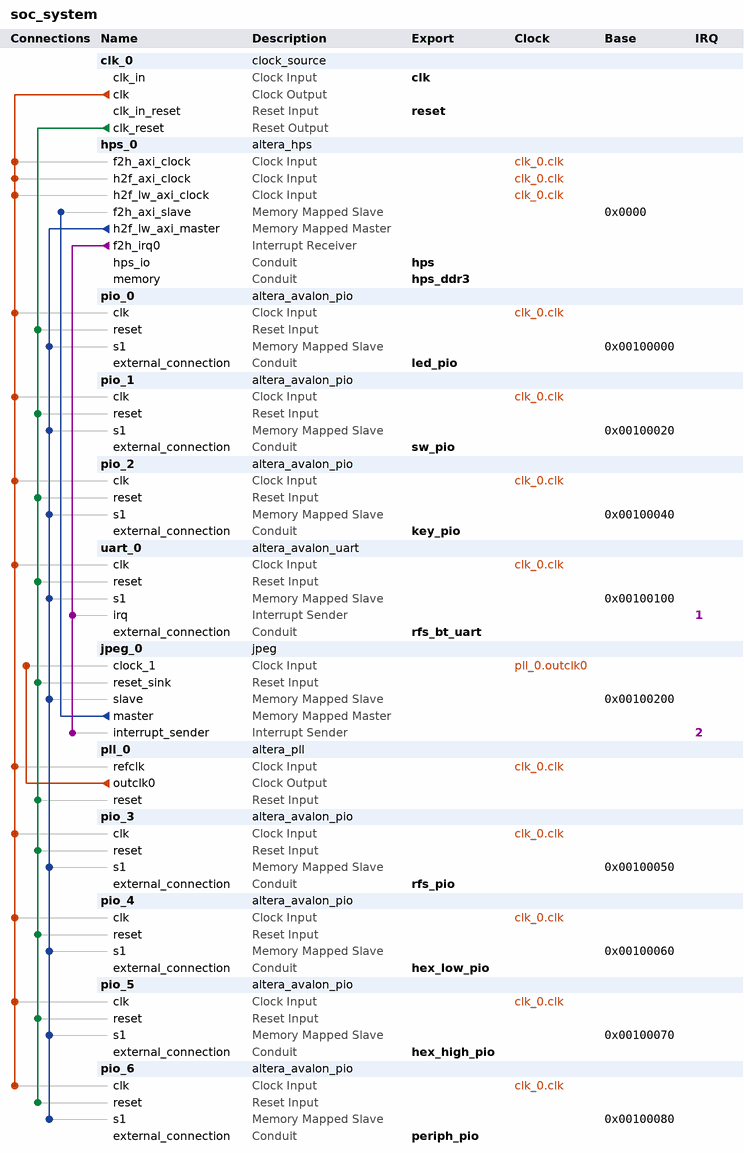
[diagram p0: system contents]
# Platform Designer (Qsys) system soc_system, Cyclone V 5CSEMA5F31C6
# Parameters at their usual value, and those the tool derives, are not listed.
package require -exact qsys 20.1
create_system soc_system
set_project_property DEVICE_FAMILY {Cyclone V}
set_project_property DEVICE 5CSEMA5F31C6

add_instance clk_0 clock_source 20.1
set_instance_parameter_value clk_0 clockFrequency 50000000

add_instance hps_0 altera_hps 20.1
set_instance_parameter_value hps_0 EMAC1_Mode RGMII
set_instance_parameter_value hps_0 EMAC1_PinMuxing {HPS I/O Set 0}
set_instance_parameter_value hps_0 F2SCLK_COLDRST_Enable false
set_instance_parameter_value hps_0 F2SCLK_DBGRST_Enable false
set_instance_parameter_value hps_0 F2SCLK_WARMRST_Enable false
set_instance_parameter_value hps_0 F2SINTERRUPT_Enable true
set_instance_parameter_value hps_0 F2S_Width 2
set_instance_parameter_value hps_0 FPGA_PERIPHERAL_OUTPUT_CLOCK_FREQ_EMAC0_GTX_CLK 125
set_instance_parameter_value hps_0 FPGA_PERIPHERAL_OUTPUT_CLOCK_FREQ_EMAC0_MD_CLK 2.5
set_instance_parameter_value hps_0 FPGA_PERIPHERAL_OUTPUT_CLOCK_FREQ_EMAC1_GTX_CLK 125
set_instance_parameter_value hps_0 FPGA_PERIPHERAL_OUTPUT_CLOCK_FREQ_EMAC1_MD_CLK 2.5
set_instance_parameter_value hps_0 HPS_PROTOCOL DDR3
set_instance_parameter_value hps_0 I2C0_Mode I2C
set_instance_parameter_value hps_0 I2C0_PinMuxing {HPS I/O Set 0}
set_instance_parameter_value hps_0 I2C1_Mode I2C
set_instance_parameter_value hps_0 I2C1_PinMuxing {HPS I/O Set 0}
set_instance_parameter_value hps_0 LWH2F_Enable true
set_instance_parameter_value hps_0 MEM_BANKADDR_WIDTH 3
set_instance_parameter_value hps_0 MEM_CLK_FREQ 400.0
set_instance_parameter_value hps_0 MEM_COL_ADDR_WIDTH 10
set_instance_parameter_value hps_0 MEM_DQ_WIDTH 32
set_instance_parameter_value hps_0 MEM_DRV_STR RZQ/7
set_instance_parameter_value hps_0 MEM_ROW_ADDR_WIDTH 15
set_instance_parameter_value hps_0 MEM_RTT_NOM RZQ/4
set_instance_parameter_value hps_0 MEM_RTT_WR RZQ/4
set_instance_parameter_value hps_0 MEM_TCL 11
set_instance_parameter_value hps_0 MEM_TFAW_NS 30.0
set_instance_parameter_value hps_0 MEM_TRAS_NS 35.0
set_instance_parameter_value hps_0 MEM_TRCD_NS 13.75
set_instance_parameter_value hps_0 MEM_TRFC_NS 260.0
set_instance_parameter_value hps_0 MEM_TRP_NS 13.75
set_instance_parameter_value hps_0 MEM_TRRD_NS 7.7
set_instance_parameter_value hps_0 MEM_VENDOR JEDEC
set_instance_parameter_value hps_0 MEM_WTCL 8
set_instance_parameter_value hps_0 QSPI_Mode N/A
set_instance_parameter_value hps_0 QSPI_PinMuxing Unused
set_instance_parameter_value hps_0 REF_CLK_FREQ 25.0
set_instance_parameter_value hps_0 S2FCLK_USER1CLK_Enable true
set_instance_parameter_value hps_0 S2FCLK_USER2CLK 5
set_instance_parameter_value hps_0 S2F_Width 2
set_instance_parameter_value hps_0 SDIO_Mode {4-bit Data}
set_instance_parameter_value hps_0 SDIO_PinMuxing {HPS I/O Set 0}
set_instance_parameter_value hps_0 SPIM1_Mode {Single Slave Select}
set_instance_parameter_value hps_0 SPIM1_PinMuxing {HPS I/O Set 0}
set_instance_parameter_value hps_0 STM_Enable false
set_instance_parameter_value hps_0 TIMING_BOARD_AC_SKEW 0.03
set_instance_parameter_value hps_0 TIMING_BOARD_AC_TO_CK_SKEW 0.0
set_instance_parameter_value hps_0 TIMING_BOARD_DQ_TO_DQS_SKEW 0.0
set_instance_parameter_value hps_0 TIMING_BOARD_MAX_CK_DELAY 0.03
set_instance_parameter_value hps_0 TIMING_BOARD_MAX_DQS_DELAY 0.02
set_instance_parameter_value hps_0 TIMING_BOARD_SKEW_BETWEEN_DQS 0.08
set_instance_parameter_value hps_0 TIMING_BOARD_SKEW_CKDQS_DIMM_MAX 0.16
set_instance_parameter_value hps_0 TIMING_BOARD_SKEW_CKDQS_DIMM_MIN 0.09
set_instance_parameter_value hps_0 TIMING_BOARD_SKEW_WITHIN_DQS 0.01
set_instance_parameter_value hps_0 TIMING_TDH 65
set_instance_parameter_value hps_0 TIMING_TDQSCK 255
set_instance_parameter_value hps_0 TIMING_TDQSQ 125
set_instance_parameter_value hps_0 TIMING_TDS 30
set_instance_parameter_value hps_0 TIMING_TIH 140
set_instance_parameter_value hps_0 TIMING_TIS 180
set_instance_parameter_value hps_0 TIMING_TQSH 0.4
set_instance_parameter_value hps_0 UART0_Mode {No Flow Control}
set_instance_parameter_value hps_0 UART0_PinMuxing {HPS I/O Set 0}
set_instance_parameter_value hps_0 USB1_Mode SDR
set_instance_parameter_value hps_0 USB1_PinMuxing {HPS I/O Set 0}
set_instance_parameter_value hps_0 desired_cfg_clk_mhz 100.0
set_instance_parameter_value hps_0 desired_qspi_clk_mhz 400.0

add_instance pio_0 altera_avalon_pio 20.1
set_instance_parameter_value pio_0 bitModifyingOutReg true
set_instance_parameter_value pio_0 direction Output
set_instance_parameter_value pio_0 width 10

add_instance pio_1 altera_avalon_pio 20.1
set_instance_parameter_value pio_1 direction Input
set_instance_parameter_value pio_1 width 10

add_instance pio_2 altera_avalon_pio 20.1
set_instance_parameter_value pio_2 direction Input
set_instance_parameter_value pio_2 width 4

add_instance uart_0 altera_avalon_uart 20.1
set_instance_parameter_value uart_0 baud 115200
set_instance_parameter_value uart_0 dataBits 8
set_instance_parameter_value uart_0 fixedBaud false
set_instance_parameter_value uart_0 parity NONE
set_instance_parameter_value uart_0 stopBits 1

add_instance jpeg_0 jpeg 1.0

add_instance pll_0 altera_pll 20.1
set_instance_parameter_value pll_0 gui_device_speed_grade 1
set_instance_parameter_value pll_0 gui_number_of_clocks 1
set_instance_parameter_value pll_0 gui_operation_mode direct
set_instance_parameter_value pll_0 gui_output_clock_frequency0 25.0
set_instance_parameter_value pll_0 gui_pll_mode {Integer-N PLL}
set_instance_parameter_value pll_0 gui_reference_clock_frequency 50.0
set_instance_parameter_value pll_0 gui_use_locked true

add_instance pio_3 altera_avalon_pio 20.1
set_instance_parameter_value pio_3 direction Output
set_instance_parameter_value pio_3 width 1

add_instance pio_4 altera_avalon_pio 20.1
set_instance_parameter_value pio_4 direction Output
set_instance_parameter_value pio_4 width 32

add_instance pio_5 altera_avalon_pio 20.1
set_instance_parameter_value pio_5 direction Output
set_instance_parameter_value pio_5 width 10

add_instance pio_6 altera_avalon_pio 20.1
set_instance_parameter_value pio_6 direction Bidir
set_instance_parameter_value pio_6 width 8

# connections
add_connection clk_0.clk hps_0.f2h_axi_clock clock
add_connection clk_0.clk hps_0.h2f_axi_clock clock
add_connection clk_0.clk hps_0.h2f_lw_axi_clock clock
add_connection clk_0.clk pio_0.clk clock
add_connection clk_0.clk pio_1.clk clock
add_connection clk_0.clk pio_2.clk clock
add_connection clk_0.clk pio_3.clk clock
add_connection clk_0.clk pio_4.clk clock
add_connection clk_0.clk pio_5.clk clock
add_connection clk_0.clk pio_6.clk clock
add_connection clk_0.clk pll_0.refclk clock
add_connection clk_0.clk uart_0.clk clock
add_connection pll_0.outclk0 jpeg_0.clock_1 clock
add_connection clk_0.clk_reset jpeg_0.reset_sink reset
add_connection clk_0.clk_reset pio_0.reset reset
add_connection clk_0.clk_reset pio_1.reset reset
add_connection clk_0.clk_reset pio_2.reset reset
add_connection clk_0.clk_reset pio_3.reset reset
add_connection clk_0.clk_reset pio_4.reset reset
add_connection clk_0.clk_reset pio_5.reset reset
add_connection clk_0.clk_reset pio_6.reset reset
add_connection clk_0.clk_reset pll_0.reset reset
add_connection clk_0.clk_reset uart_0.reset reset
add_connection hps_0.h2f_lw_axi_master jpeg_0.slave avalon
set_connection_parameter_value hps_0.h2f_lw_axi_master/jpeg_0.slave baseAddress 0x00100200
add_connection hps_0.h2f_lw_axi_master pio_0.s1 avalon
set_connection_parameter_value hps_0.h2f_lw_axi_master/pio_0.s1 baseAddress 0x00100000
add_connection hps_0.h2f_lw_axi_master pio_1.s1 avalon
set_connection_parameter_value hps_0.h2f_lw_axi_master/pio_1.s1 baseAddress 0x00100020
add_connection hps_0.h2f_lw_axi_master pio_2.s1 avalon
set_connection_parameter_value hps_0.h2f_lw_axi_master/pio_2.s1 baseAddress 0x00100040
add_connection hps_0.h2f_lw_axi_master pio_3.s1 avalon
set_connection_parameter_value hps_0.h2f_lw_axi_master/pio_3.s1 baseAddress 0x00100050
add_connection hps_0.h2f_lw_axi_master pio_4.s1 avalon
set_connection_parameter_value hps_0.h2f_lw_axi_master/pio_4.s1 baseAddress 0x00100060
add_connection hps_0.h2f_lw_axi_master pio_5.s1 avalon
set_connection_parameter_value hps_0.h2f_lw_axi_master/pio_5.s1 baseAddress 0x00100070
add_connection hps_0.h2f_lw_axi_master pio_6.s1 avalon
set_connection_parameter_value hps_0.h2f_lw_axi_master/pio_6.s1 baseAddress 0x00100080
add_connection hps_0.h2f_lw_axi_master uart_0.s1 avalon
set_connection_parameter_value hps_0.h2f_lw_axi_master/uart_0.s1 baseAddress 0x00100100
add_connection jpeg_0.master hps_0.f2h_axi_slave avalon
set_connection_parameter_value jpeg_0.master/hps_0.f2h_axi_slave baseAddress 0x0000
add_connection hps_0.f2h_irq0 jpeg_0.interrupt_sender interrupt
set_connection_parameter_value hps_0.f2h_irq0/jpeg_0.interrupt_sender irqNumber 2
add_connection hps_0.f2h_irq0 uart_0.irq interrupt
set_connection_parameter_value hps_0.f2h_irq0/uart_0.irq irqNumber 1

# exported interfaces
add_interface clk clock sink
set_interface_property clk EXPORT_OF clk_0.clk_in
add_interface hex_high_pio conduit end
set_interface_property hex_high_pio EXPORT_OF pio_5.external_connection
add_interface hex_low_pio conduit end
set_interface_property hex_low_pio EXPORT_OF pio_4.external_connection
add_interface hps conduit end
set_interface_property hps EXPORT_OF hps_0.hps_io
add_interface hps_ddr3 conduit end
set_interface_property hps_ddr3 EXPORT_OF hps_0.memory
add_interface key_pio conduit end
set_interface_property key_pio EXPORT_OF pio_2.external_connection
add_interface led_pio conduit end
set_interface_property led_pio EXPORT_OF pio_0.external_connection
add_interface periph_pio conduit end
set_interface_property periph_pio EXPORT_OF pio_6.external_connection
add_interface reset reset sink
set_interface_property reset EXPORT_OF clk_0.clk_in_reset
add_interface rfs_bt_uart conduit end
set_interface_property rfs_bt_uart EXPORT_OF uart_0.external_connection
add_interface rfs_pio conduit end
set_interface_property rfs_pio EXPORT_OF pio_3.external_connection
add_interface sw_pio conduit end
set_interface_property sw_pio EXPORT_OF pio_1.external_connection

set_interconnect_requirement {$system} qsys_mm.clockCrossingAdapter HANDSHAKE
set_interconnect_requirement {$system} qsys_mm.enableEccProtection FALSE
set_interconnect_requirement {$system} qsys_mm.insertDefaultSlave FALSE
set_interconnect_requirement {$system} qsys_mm.maxAdditionalLatency 1

save_system soc_system.qsys
